# Altium schematic sheet Connector.SchDoc
size A
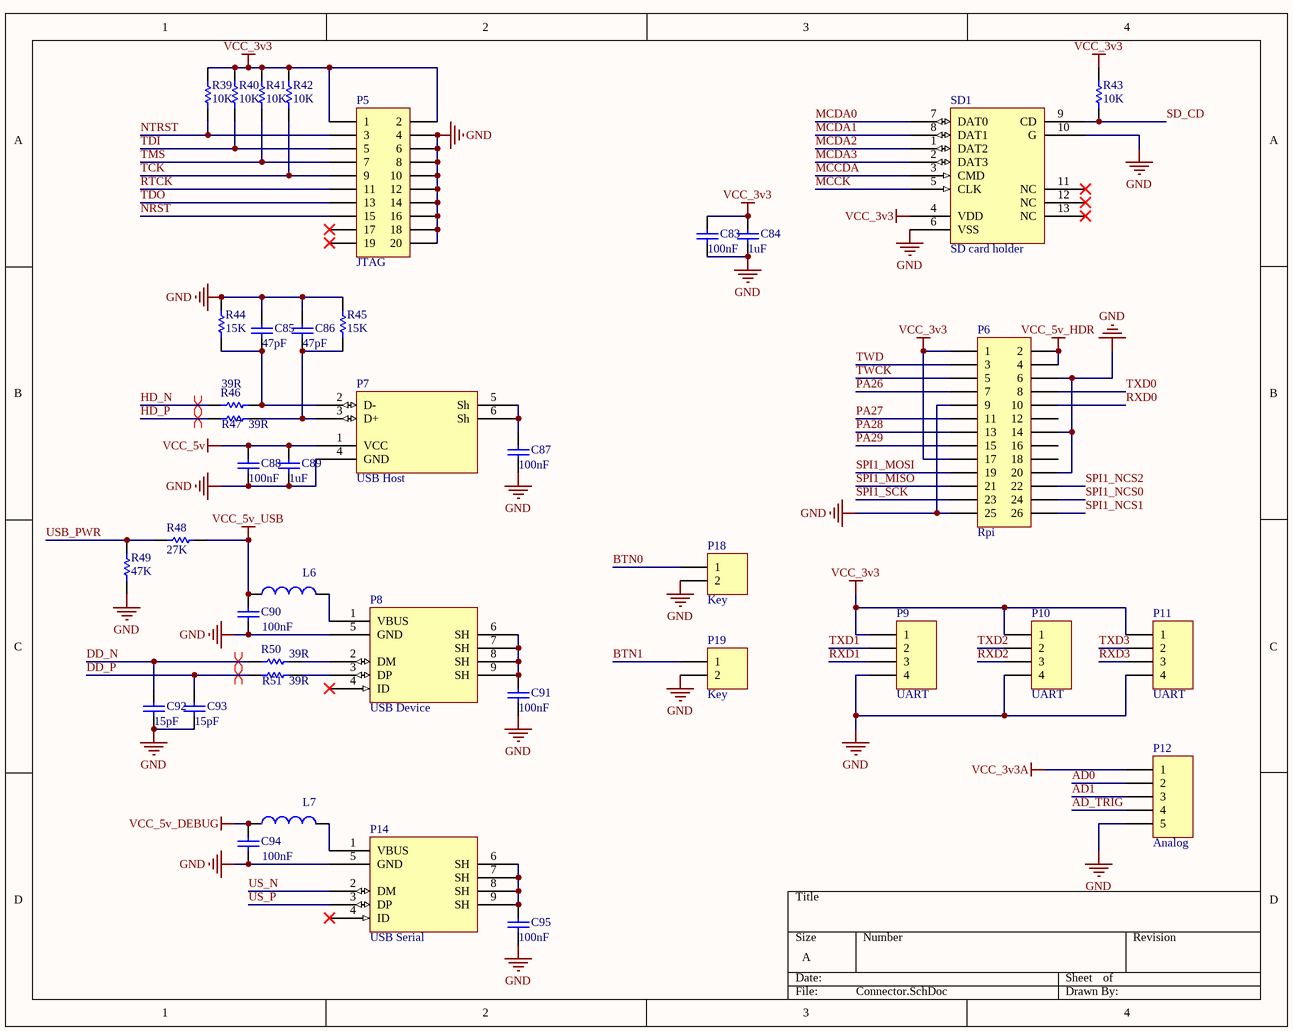
[diagram p0: Connector.SchDoc]

## Parts
C83  value 100nF  [C0805]  (hidden comment: Cap)
C84  value 1uF  [C0805]  (hidden comment: Cap)
C85  value 47pF  [C0805]  (hidden comment: Cap)
C86  value 47pF  [C0805]  (hidden comment: Cap)
C87  value 100nF  [C0805]  (hidden comment: Cap)
C88  value 100nF  [C0805]  (hidden comment: Cap)
C89  value 1uF  [C0805]  (hidden comment: Cap)
C90  value 100nF  [C0805]  (hidden comment: Cap)
C91  value 100nF  [C0805]  (hidden comment: Cap)
C92  value 15pF  [C0805]  (hidden comment: Cap)
C93  value 15pF  [C0805]  (hidden comment: Cap)
C94  value 100nF  [C0805]  (hidden comment: Cap)
C95  value 100nF  [C0805]  (hidden comment: Cap)
L6  Ferrite Bead  [C0805]  (value not drawn)
L7  Ferrite Bead  [C0805]  (value not drawn)
P5  JTAG  [IDC_2X10]
P6  Rpi  [HDR2X13]
P7  USB Host  [USB_Female]
P8  USB Device  [Mini USB]
P9  UART  [XH_4pin]
P10  UART  [XH_4pin]
P11  UART  [XH_4pin]
P12  Analog  [XH_5pin]
P14  USB Serial  [Mini USB]
P18  Key  [HDR1X2]
P19  Key  [HDR1X2]
R39  value 10K  [C0805]  (hidden comment: Res Semi)
R40  value 10K  [C0805]  (hidden comment: Res Semi)
R41  value 10K  [C0805]  (hidden comment: Res Semi)
R42  value 10K  [C0805]  (hidden comment: Res Semi)
R43  value 10K  [C0805]  (hidden comment: Res Semi)
R44  value 15K  [C0805]  (hidden comment: Res Semi)
R45  value 15K  [C0805]  (hidden comment: Res Semi)
R46  value 39R  [C0805]  (hidden comment: Res Semi)
R47  value 39R  [C0805]  (hidden comment: Res Semi)
R48  value 27K  [C0805]  (hidden comment: Res Semi)
R49  value 47K  [C0805]  (hidden comment: Res Semi)
R50  value 39R  [C0805]  (hidden comment: Res Semi)
R51  value 39R  [C0805]  (hidden comment: Res Semi)
SD1  SD card holder  [MicroSD socket]

## Nets
GND: C83.1 C84.1 C85.2 C86.2 C87.1 C88.1 C89.1 C90.1 C91.1 C92.1 C93.1 C94.1 C95.1 P5.4 P5.6 P5.8 P5.10 P5.12 P5.14 P5.16 P5.18 P5.20 P6.6 P6.9 P6.14 P6.20 P6.25 P7.4(GND) P8.5(GND) P9.4 P10.4 P11.4 P12.5 P14.5(GND) P18.2 P19.2 R44.1 R45.1 R49.2 SD1.6(VSS) SD1.10(G)
VCC_3v3: C83.2 C84.2 P5.1 P5.2 P6.1 P6.17 P9.1 P10.1 P11.1 R39.1 R40.1 R41.1 R42.1 R43.1 SD1.4(VDD)
VCC_3v3A: P12.1
VCC_5v: C88.2 C89.2 P7.1(VCC)
VCC_5v_DEBUG: C94.2 L7.1
VCC_5v_HDR: P6.2 P6.4
VCC_5v_USB: C90.2 L6.1 R48.1
AD0: P12.2
AD1: P12.3
AD_TRIG: P12.4
BTN0: P18.1
BTN1: P19.1
DD_N: C92.2 R50.1
DD_P: C93.2 R51.1
HD_N: R46.1
HD_P: R47.1
MCCDA: SD1.3(CMD)
MCCK: SD1.5(CLK)
MCDA0: SD1.7(DAT0)
MCDA1: SD1.8(DAT1)
MCDA2: SD1.1(DAT2)
MCDA3: SD1.2(DAT3)
NRST: P5.15
NTRST: P5.3 R39.2
PA26: P6.7
PA27: P6.11
PA28: P6.13
PA29: P6.15
RTCK: P5.11
RXD0: P6.10
RXD1: P9.3
RXD2: P10.3
RXD3: P11.3
SD_CD: R43.2 SD1.9(CD)
SPI1_MISO: P6.21
SPI1_MOSI: P6.19
SPI1_NCS0: P6.24
SPI1_NCS1: P6.26
SPI1_NCS2: P6.22
SPI1_SCK: P6.23
TCK: P5.9 R42.2
TDI: P5.5 R40.2
TDO: P5.13
TMS: P5.7 R41.2
TWCK: P6.5
TWD: P6.3
TXD0: P6.8
TXD1: P9.2
TXD2: P10.2
TXD3: P11.2
US_N: P14.2(DM)
US_P: P14.3(DP)
USB_PWR: R48.2 R49.1
NetC85_1: C85.1 P7.2(D-) R44.2 R46.2
NetC86_1: C86.1 P7.3(D+) R45.2 R47.2
NetC87_2: C87.2 P7.5(Sh) P7.6(Sh)
NetC91_2: C91.2 P8.6(SH) P8.7(SH) P8.8(SH) P8.9(SH)
NetC95_2: C95.2 P14.6(SH) P14.7(SH) P14.8(SH) P14.9(SH)
NetL6_2: L6.2 P8.1(VBUS)
NetL7_2: L7.2 P14.1(VBUS)
NetP8_2: P8.2(DM) R50.2
NetP8_3: P8.3(DP) R51.2

Not connected (* = marked no-connect by the designer): P5 17* 19*; P6 12 16 18; P8 4(ID)*; P14 4(ID)*; SD1 11(NC)* 12(NC)* 13(NC)*

## Layout directives
differential pair: DD_N, DD_P, HD_N, HD_P

## Library data of the parts
C83-C95 = Cap: Capacitor; Published: 8-Jun-2000; LatestRevisionDate: 17-Jul-2002; LatestRevisionNote: Re-released for DXP Platform.; PackageReference: RAD-0.3; Publisher: Altium Limited; PackageDescription: Radial Cap, Thru-Hole; 2 Leads; 0.3 in Pin Spacing
L6 L7 = Inductor: Code_IEC: 1005; Value: 10mH; Published: 8-Jun-2000; LatestRevisionDate: 29-May-2009; LatestRevisionNote: IPC-7351 Footprint Added.; PackageReference: 0402-A; Publisher: Altium Limited; PackageDescription: Chip Inductor; Code_JEITA: 0402
P5 = Header 10X2: Header, 10-Pin, Dual row; LatestRevisionDate: 17-Jul-2002; LatestRevisionNote: Re-released for DXP Platform.; Publisher: Altium Limited
P6 = Header 13X2: Header, 13-Pin, Dual row; LatestRevisionDate: 17-Jul-2002; LatestRevisionNote: Re-released for DXP Platform.; Publisher: Altium Limited
P8 P14 = Mini USB
P9-P11 = Header 4: Header, 4-Pin; LatestRevisionDate: 17-Jul-2002; LatestRevisionNote: Re-released for DXP Platform.; Publisher: Altium Limited
P12 = Header 5: Header, 5-Pin; LatestRevisionDate: 17-Jul-2002; LatestRevisionNote: Re-released for DXP Platform.; Publisher: Altium Limited
P18 P19 = Header 2: Header, 2-Pin; LatestRevisionDate: 17-Jul-2002; LatestRevisionNote: Re-released for DXP Platform.; Publisher: Altium Limited
R39-R51 = Res Semi: Semiconductor Resistor; Published: 8-Jun-2000; LatestRevisionDate: 17-Jul-2002; LatestRevisionNote: Re-released for DXP Platform.; PackageReference: AXIAL-0.5; Publisher: Altium Limited; PackageDescription: Axial Device, Thru-Hole; 2 Leads; 0.5 in Pin Spacing
SD1 = MicroSD_holder